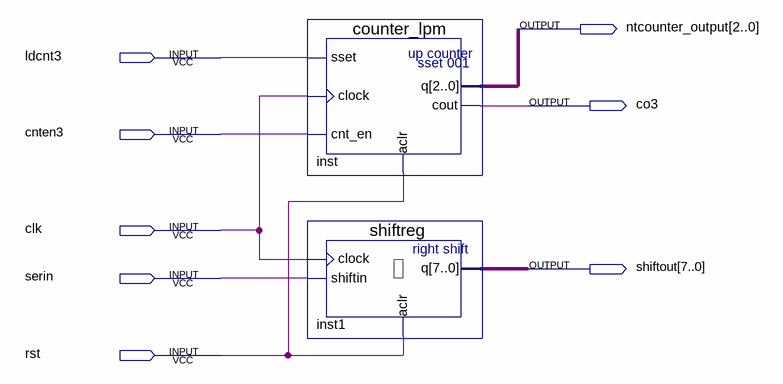
[diagram p0: schematic sheet]
// Quartus schematic nt_counter.bdf as structural Verilog: 2 symbols, 8 pins
module nt_counter (
  input  ldcnt3,
  input  cnten3,
  input  clk,
  input  serin,
  input  rst,
  output [2:0] ntcounter_output,
  output co3,
  output [7:0] shiftout
);

  counter_lpm inst (.sset(ldcnt3), .clock(clk), .cnt_en(cnten3), .aclr(rst), .cout(co3), .q(ntcounter_output));
  shiftreg inst1 (.clock(clk), .shiftin(serin), .aclr(rst), .q(shiftout));
endmodule
